# EAGLE design motor (EAGLE 7.4.0)
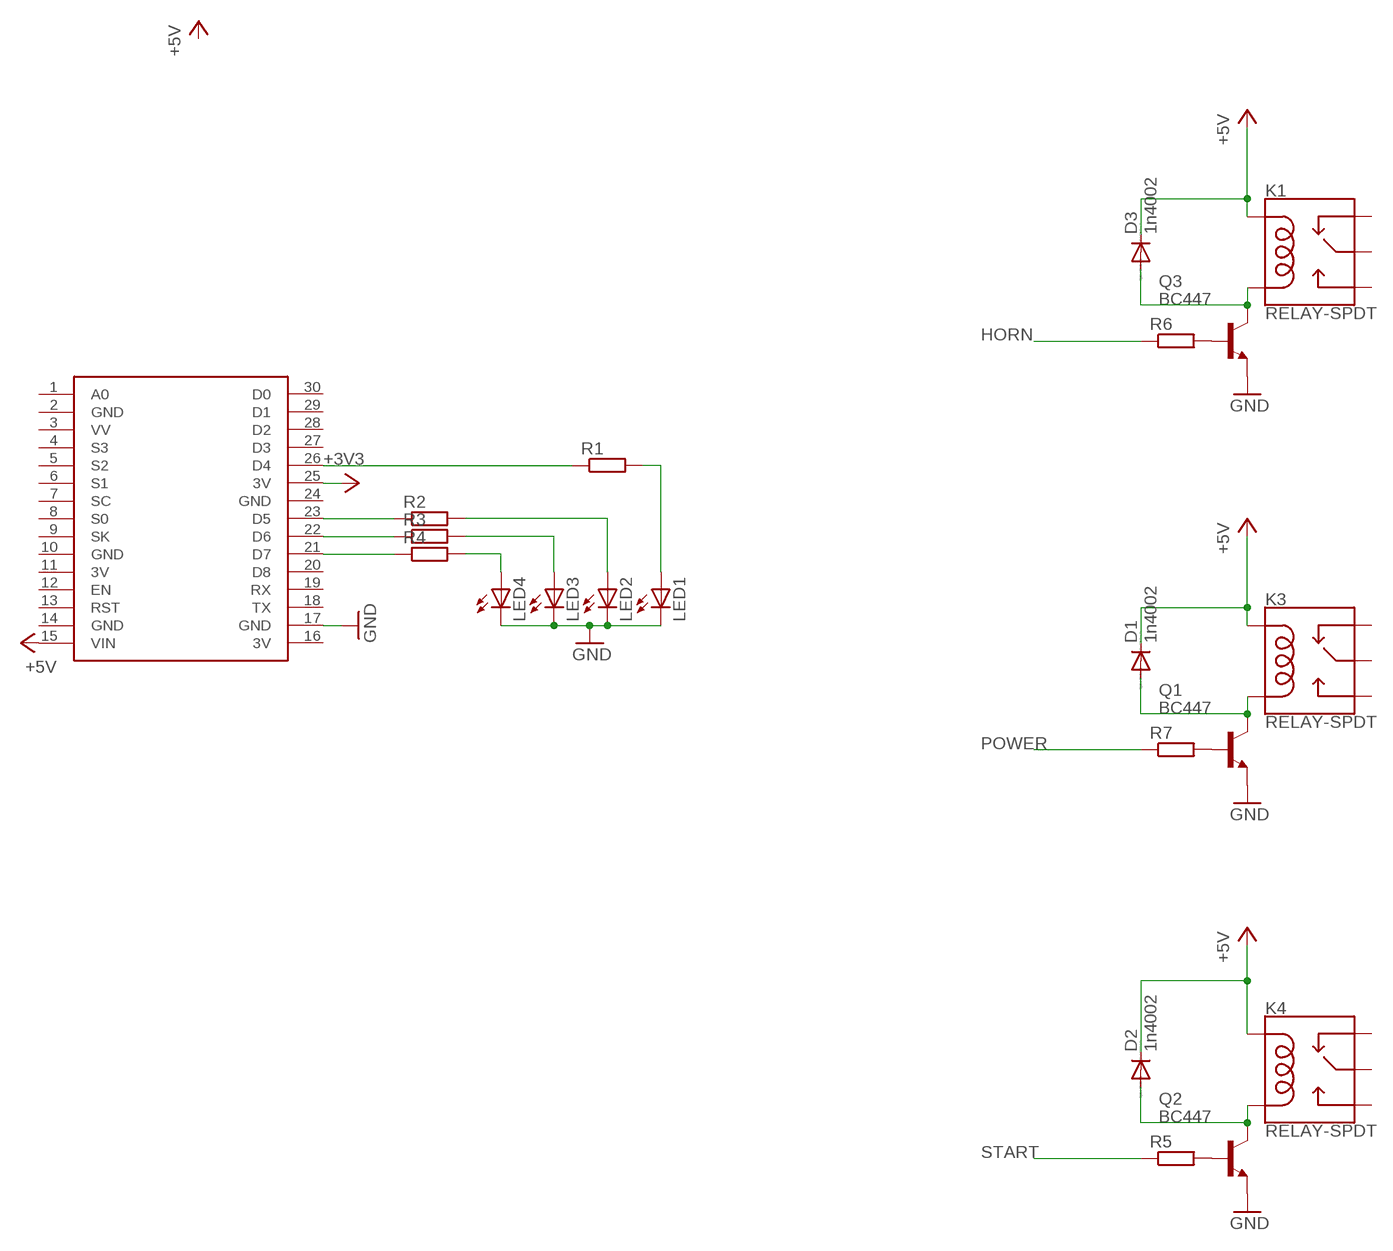
[diagram p0: schematic, sheet 1]

## Parts
D1  1n4002  1N4446  [DO35-10]
D2  1n4002  1N4446  [DO35-10]
D3  1n4002  1N4446  [DO35-10]
K1  RELAY-SPDT  [RELAY_G5LE]
K3  RELAY-SPDT  [RELAY_G5LE]
K4  RELAY-SPDT  [RELAY_G5LE]
LED1  LED5MM  [LED5MM]
LED2  LED5MM  [LED5MM]
LED3  LED5MM  [LED5MM]
LED4  LED5MM  [LED5MM]
Q1  BC447  [TO92-EBC]
Q2  BC447  [TO92-EBC]
Q3  BC447  [TO92-EBC]
R1  R-EU_0207/10  [0207/10]
R2  R-EU_0207/10  [0207/10]
R3  R-EU_0207/10  [0207/10]
R4  R-EU_0207/10  [0207/10]
R5  R-EU_0207/10  [0207/10]
R6  R-EU_0207/10  [0207/10]
R7  R-EU_0207/10  [0207/10]
U$2  NODEMCU  [NODEMCU]

## Nets
+3V3: U$2.25(3V)
+5V: D1.C D2.C D3.C K1.2(COIL1) K3.2(COIL1) K4.2(COIL1) U$2.15(VIN)
GND: LED1.K(C) LED2.K(C) LED3.K(C) LED4.K(C) Q1.E Q2.E Q3.E U$2.17(GND)
HORN: R6.1
N$1: R1.1 U$2.26(D4)
N$2: D3.A K1.5(COIL2) Q3.C
N$3: R3.1 U$2.22(D6)
N$4: R4.1 U$2.21(D7)
N$5: LED1.A R1.2
N$6: LED2.A R2.2
N$7: LED3.A R3.2
N$8: LED4.A R4.2
N$9: Q3.B R6.2
N$11: D2.A K4.5(COIL2) Q2.C
N$12: Q2.B R5.2
N$13: R2.1 U$2.23(D5)
N$14: D1.A K3.5(COIL2) Q1.C
N$15: Q1.B R7.2
POWER: R7.1
START: R5.1
Unconnected: K1.1(MAIN) K1.3(NO) K1.4(NC) K3.1(MAIN) K3.3(NO) K3.4(NC) K4.1(MAIN) K4.3(NO) K4.4(NC) U$2.1(A0) U$2.3(VV) U$2.4(S3) U$2.5(S2) U$2.6(S1) U$2.7(SC) U$2.8(S0) U$2.9(SK) U$2.12(EN) U$2.13(RST) U$2.18(TX) U$2.19(RX) U$2.20(D8) U$2.27(D3) U$2.28(D2) U$2.29(D1) U$2.30(D0)

## Power pins joined to a net without a drawn wire
3V: U$2.11(3V) U$2.16(3V)
GND: U$2.2(GND) U$2.10(GND) U$2.14(GND) U$2.24(GND)

## Library data of the parts
D1-D3 = diode:1N4446: DIODE high speed (Philips)
K1 K3 K4 = SparkFun-Electromechanical:RELAY-SPDT: SPDT Electromechanical Relay Single-pole, double-throw sealed relays. When current is applied to the coil, it throws a simple changeover switch, terminating the connection from the NC contact to ground and closing the NO contact. Use them to switch high voltage/high current devices. SparkFun Products JQX-15F: Relay SPDT Sealed - 20A <https://www.sparkfun.com/products/10924> (COM-10924) JZC-11F: Relay SPDT Sealed <https://www.sparkfun.com/products/100> (COM-00100); PROD_ID: COMP-14214
LED1-LED4 = led:LED: LED OSRAM: - CHIPLED LG R971, LG N971, LY N971, LG Q971, LY Q971, LO R971, LY R971 LH N974, LH R974 LS Q976, LO Q976, LY Q976 LO Q996 - Hyper CHIPLED LW Q18S LB Q993, LB Q99A, LB R99A - SideLED LS A670, LO A670, LY A670, LG A670, LP A670 LB A673, LV A673, LT A673, LW A673 LH A674 LY A675 LS A676, LA A676, LO A676, LY A676, LW A676 LS A679, LY A679, LG A679 - Hyper Micro SIDELED® LS Y876, LA Y876, LO Y876, LY Y876 LT Y87S - SmartLED LW L88C, LW L88S LB L89C, LB L89S, LG L890 LS L89K, LO L89K, LY L89K LS L896, LA L896, LO L896, LY L896 - TOPLED LS T670, LO T670, LY T670, LG T670, LP T670 LSG T670, LSP T670, LSY T670, LOP T670, LYG T670 LG T671, LOG T671, LSG T671 LB T673, LV T673, LT T673, LW T673 LH T674 LS T676, LA T676, LO T676, LY T676, LB T676, LH T676, LSB T676, LW T676 LB T67C, LV T67C, LT T67C, LS T67K, LO T67K, LY T67K, LW E67C LS E67B, LA E67B, LO E67B, LY E67B, LB E67C, LV E67C, LT E67C LW T67C LS T679, LY T679, LG T679 LS T770, LO T770, LY T770, LG T770, LP T770 LB T773, LV T773, LT T773, LW T773 LH T774 LS E675, LA E675, LY E675, LS T675 LS T776, LA T776, LO T776, LY T776, LB T776 LHGB T686 LT T68C, LB T68C - Hyper Mini TOPLED® LB M676 - Mini TOPLED Santana® LG M470 LS M47K, LO M47K, LY M47K Source: http://www.osram.convergy.de LUXEON: - LUMILED® LXK2-PW12-R00, LXK2-PW12-S00, LXK2-PW14-U00, LXK2-PW14-V00 LXK2-PM12-R00, LXK2-PM12-S00, LXK2-PM14-U00 LXK2-PE12-Q00, LXK2-PE12-R00, LXK2-PE12-S00, LXK2-PE14-T00, LXK2-PE14-U00 LXK2-PB12-K00, LXK2-PB12-L00, LXK2-PB12-M00, LXK2-PB14-N00, LXK2-PB14-P00, LXK2-PB14-Q00 LXK2-PR12-L00, LXK2-PR12-M00, LXK2-PR14-Q00, LXK2-PR14-R00 LXK2-PD12-Q00, LXK2-PD12-R00, LXK2-PD12-S00 LXK2-PH12-R00, LXK2-PH12-S00 LXK2-PL12-P00, LXK2-PL12-Q00, LXK2-PL12-R00 Source: www.luxeon.com KINGBRIGHT: KA-3528ASYC Source: www.kingbright.com
Q1-Q3 = transistor-npn:BC447*: NPN Transistor
R1-R7 = rcl:R-EU_: RESISTOR, European symbol
U$2 = nodemcu:NODEMCU

## Board
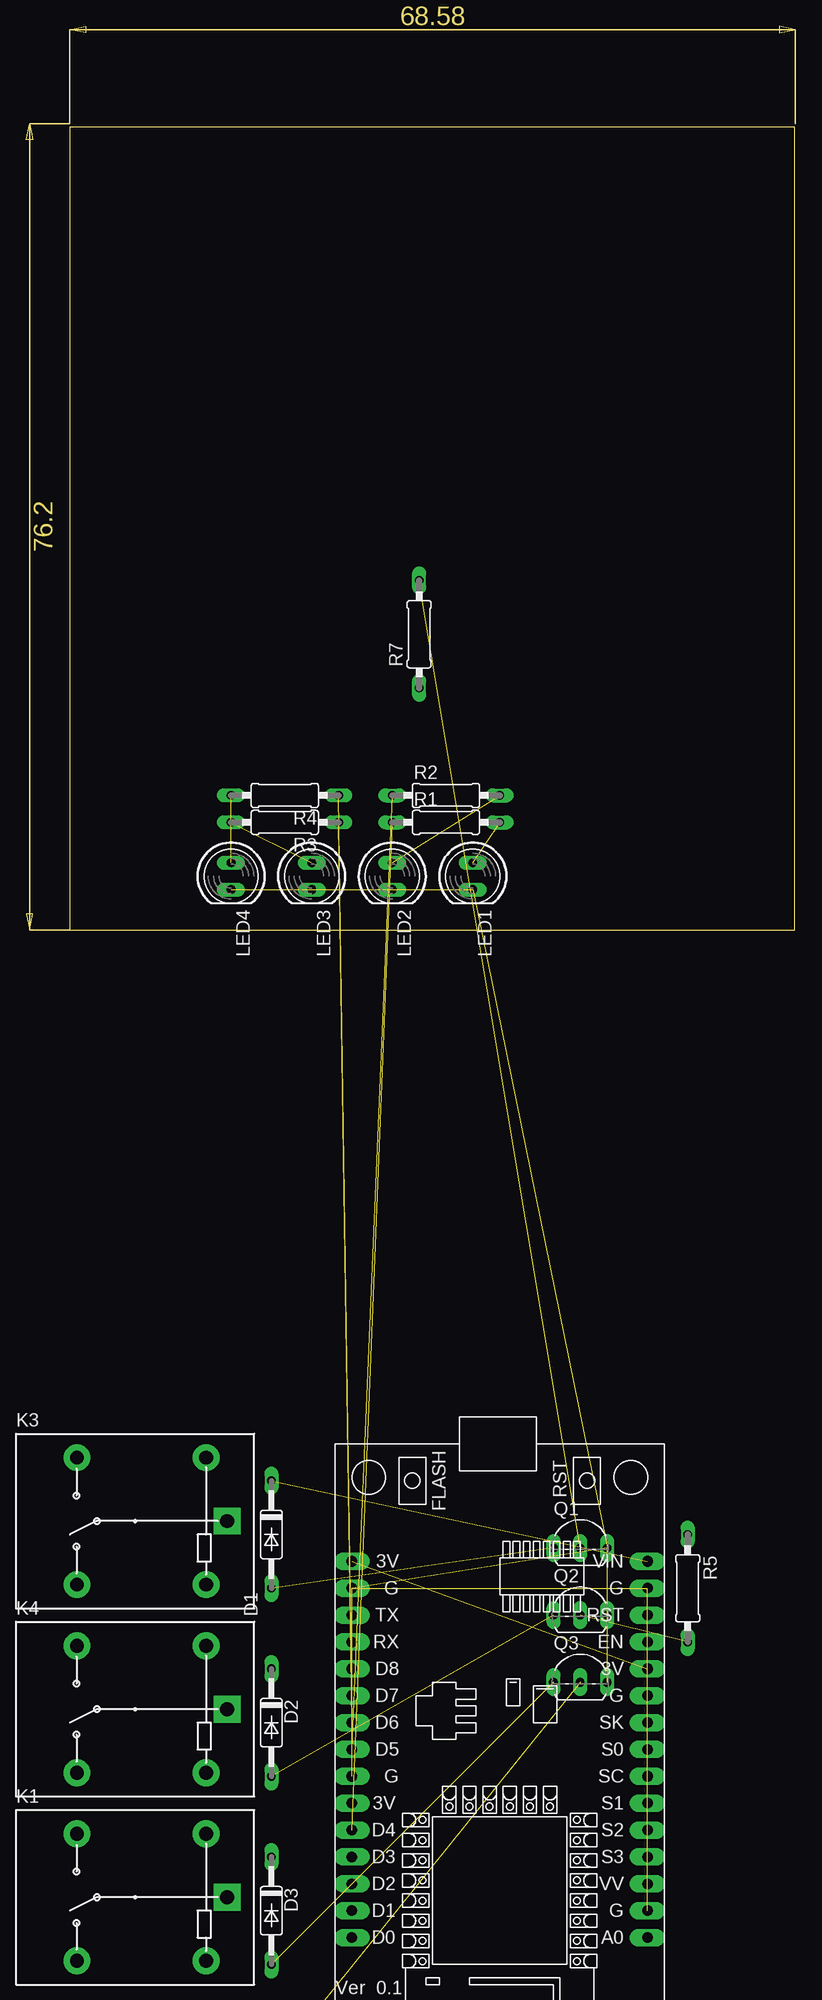
[diagram p1: board, top side]
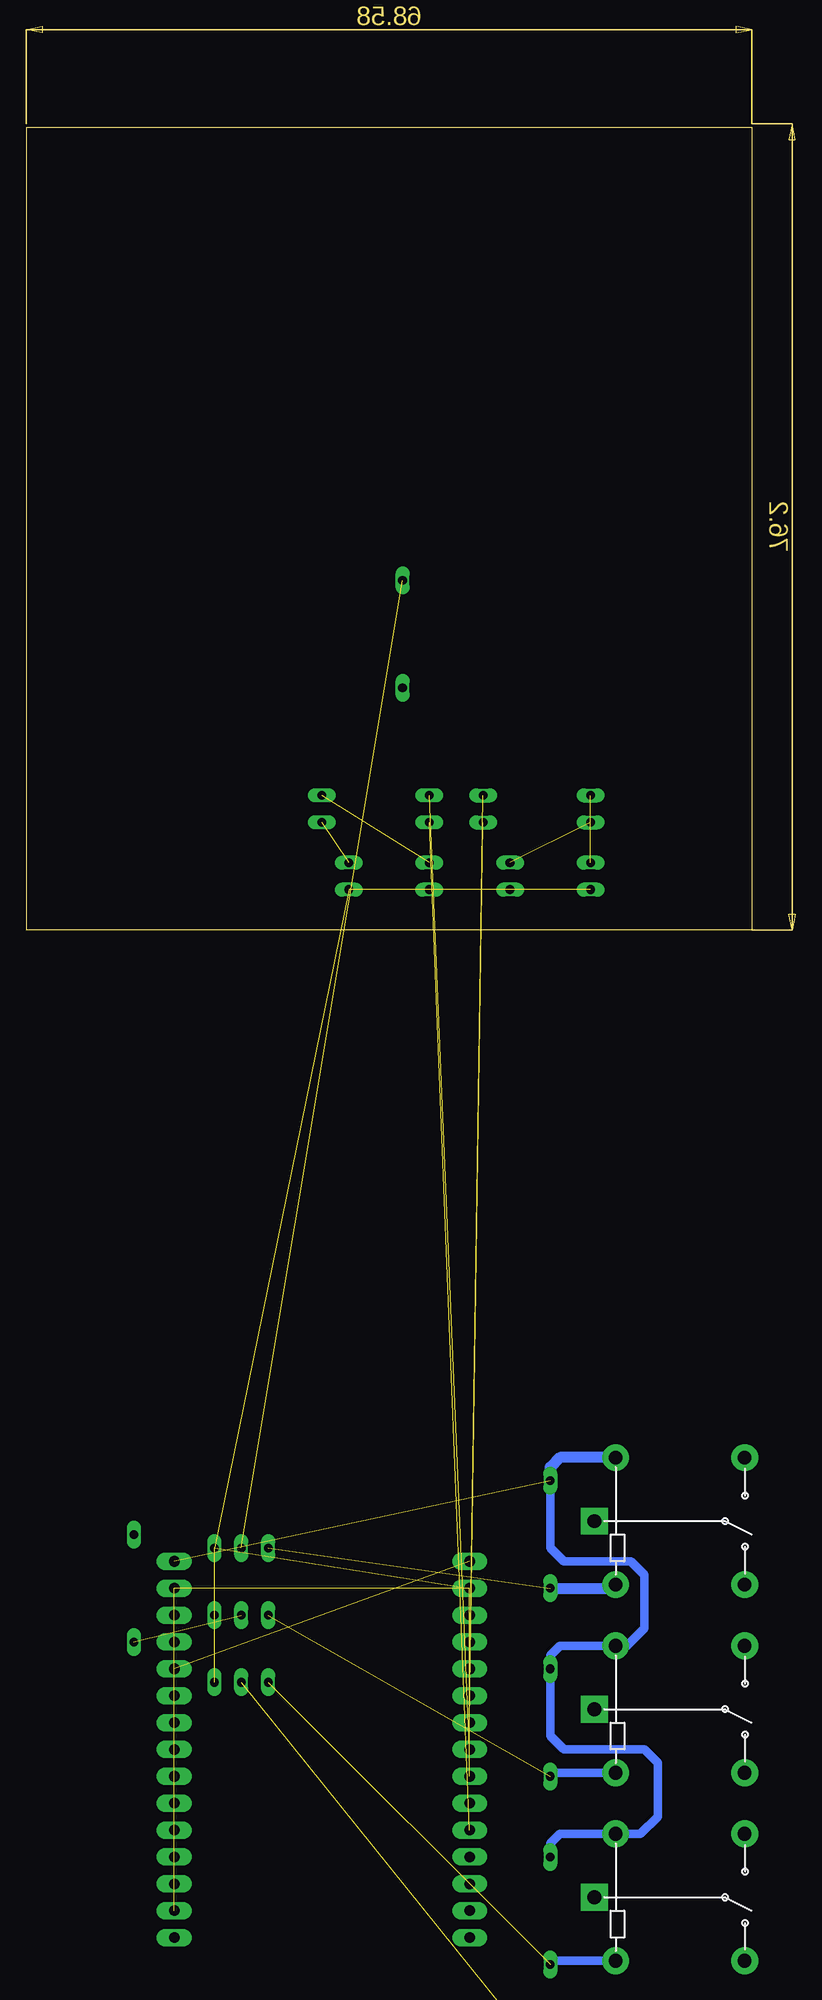
[diagram p2: board, bottom side, seen from below]

Size 72.69 x 85.39 mm. Coordinates in mm from the lower left corner, seen from the top.
Outline: 4.11,0 72.67,0 72.67,75.87 4.11,75.87 4.11,0
Copper layers (1*16): Top 0.035mm / dielectric 1.5mm / Bottom 0.035mm
Design rules "default": minimum track width 10mil, minimum drill 24mil, track to track 8mil, track to pad 8mil, pad to pad 8mil, via to via 8mil, smd to smd 8mil, copper to edge 40mil, drill to drill 8mil, minimum pad ring 10mil, minimum via ring 8mil, stop-mask expansion 4mil, vias tented up to drill 0mil, thermal gap 10mil

### Footprints (pad centres in the part's own frame; a part is rotated, then mirrored left to right if it is on the bottom)
DO35-10 = drill 0.813 long: A 5.08,0; C -5.08,0
RELAY_G5LE = drill 1.3 pad 2.54 square: 1 8.52,-0.005 | drill 1.3 pad 2.54: 2 6.52,5.995; 3 -5.68,5.995; 4 -5.68,-6.005; 5 6.52,-6.005
LED5MM = drill 0.813 long: A -1.27,0; K 1.27,0
TO92-EBC = drill 0.813 long: B 0,-1.27; C -2.54,-1.27; E 2.54,-1.27
0207/10 = drill 0.813 long: 1 -5.08,0; 2 5.08,0
NODEMCU = drill 1 pad 1.676 long: 1 -13.97,17.78; 2 -13.97,15.24; 3 -13.97,12.7; 4 -13.97,10.16; 5 -13.97,7.62; 6 -13.97,5.08; 7 -13.97,2.54; 8 -13.97,0; 9 -13.97,-2.54; 10 -13.97,-5.08; 11 -13.97,-7.62; 12 -13.97,-10.16; 13 -13.97,-12.7; 14 -13.97,-15.24; 15 -13.97,-17.78; 16 13.97,-17.78; 17 13.97,-15.24; 18 13.97,-12.7; 19 13.97,-10.16; 20 13.97,-7.62; 21 13.97,-5.08; 22 13.97,-2.54; 23 13.97,0; 24 13.97,2.54; 25 13.97,5.08; 26 13.97,7.62; 27 13.97,10.16; 28 13.97,12.7; 29 13.97,15.24; 30 13.97,17.78

### Placement (x,y rotation side)
D1  23.16,-57.15 270 top  (outside the outline)
D2  23.16,-74.93 270 top  (outside the outline)
D3  23.16,-92.71 270 top  (outside the outline)
K1  10.46,-91.44 0 top  (outside the outline)
K3  10.46,-55.88 0 top  (outside the outline)
K4  10.46,-73.66 0 top  (outside the outline)
LED1  42.21,5.08 270 top
LED2  34.59,5.08 270 top
LED3  26.97,5.08 270 top
LED4  19.35,5.08 270 top
Q1  52.37,-57.15 0 top  (outside the outline)
Q2  52.37,-63.5 0 top  (outside the outline)
Q3  52.37,-69.85 0 top  (outside the outline)
R1  39.67,10.16 0 top
R2  39.67,12.7 0 top
R3  24.43,10.16 180 top
R4  24.43,12.7 180 top
R5  62.53,-62.23 270 top  (outside the outline)
R6  5.38,-123.19 0 top  (outside the outline)
R7  37.13,27.94 90 top
U$2  44.75,-77.47 180 top  (outside the outline)

### Tracks (layer width: path | path; a pad name or v marks a point on that pad's centre or on a via)
3V  (1 unrouted)
+5V  (1 unrouted)
  Bottom 0.813: D1.C 23.16,-58.42 21.89,-59.69 15.54,-59.69 14.27,-60.96 14.27,-66.04 15.89,-67.67 K4.2 22.25,-67.67 23.16,-68.58 D2.C 23.16,-76.2 21.89,-77.47 14.27,-77.47 13,-78.74 13,-83.82 14.62,-85.44 K1.2 22.25,-85.44 23.16,-86.36 D3.C
  Bottom 1.016: K3.2 22.25,-49.89 23.16,-50.8 D1.C
GND  (11 unrouted)
N$1  (1 unrouted)
N$2  (1 unrouted)
  Bottom 0.813: K1.5 22.81,-97.44 D3.A
N$3  (1 unrouted)
N$4  (1 unrouted)
N$5  (1 unrouted)
N$6  (1 unrouted)
N$7  (1 unrouted)
N$8  (1 unrouted)
N$9  (1 unrouted)
N$11  (1 unrouted)
  Bottom 0.813: K4.5 22.81,-79.66 D2.A
N$12  (1 unrouted)
N$13  (1 unrouted)
N$14  (1 unrouted)
  Bottom 1.016: D1.A 16.98,-62.23 K3.5
N$15  (1 unrouted)